# EasyEDA Pro project ProPrj_Isolated Current Sensing_latest_2025-08-29.epro, board PCB_Isolated Current Sensing
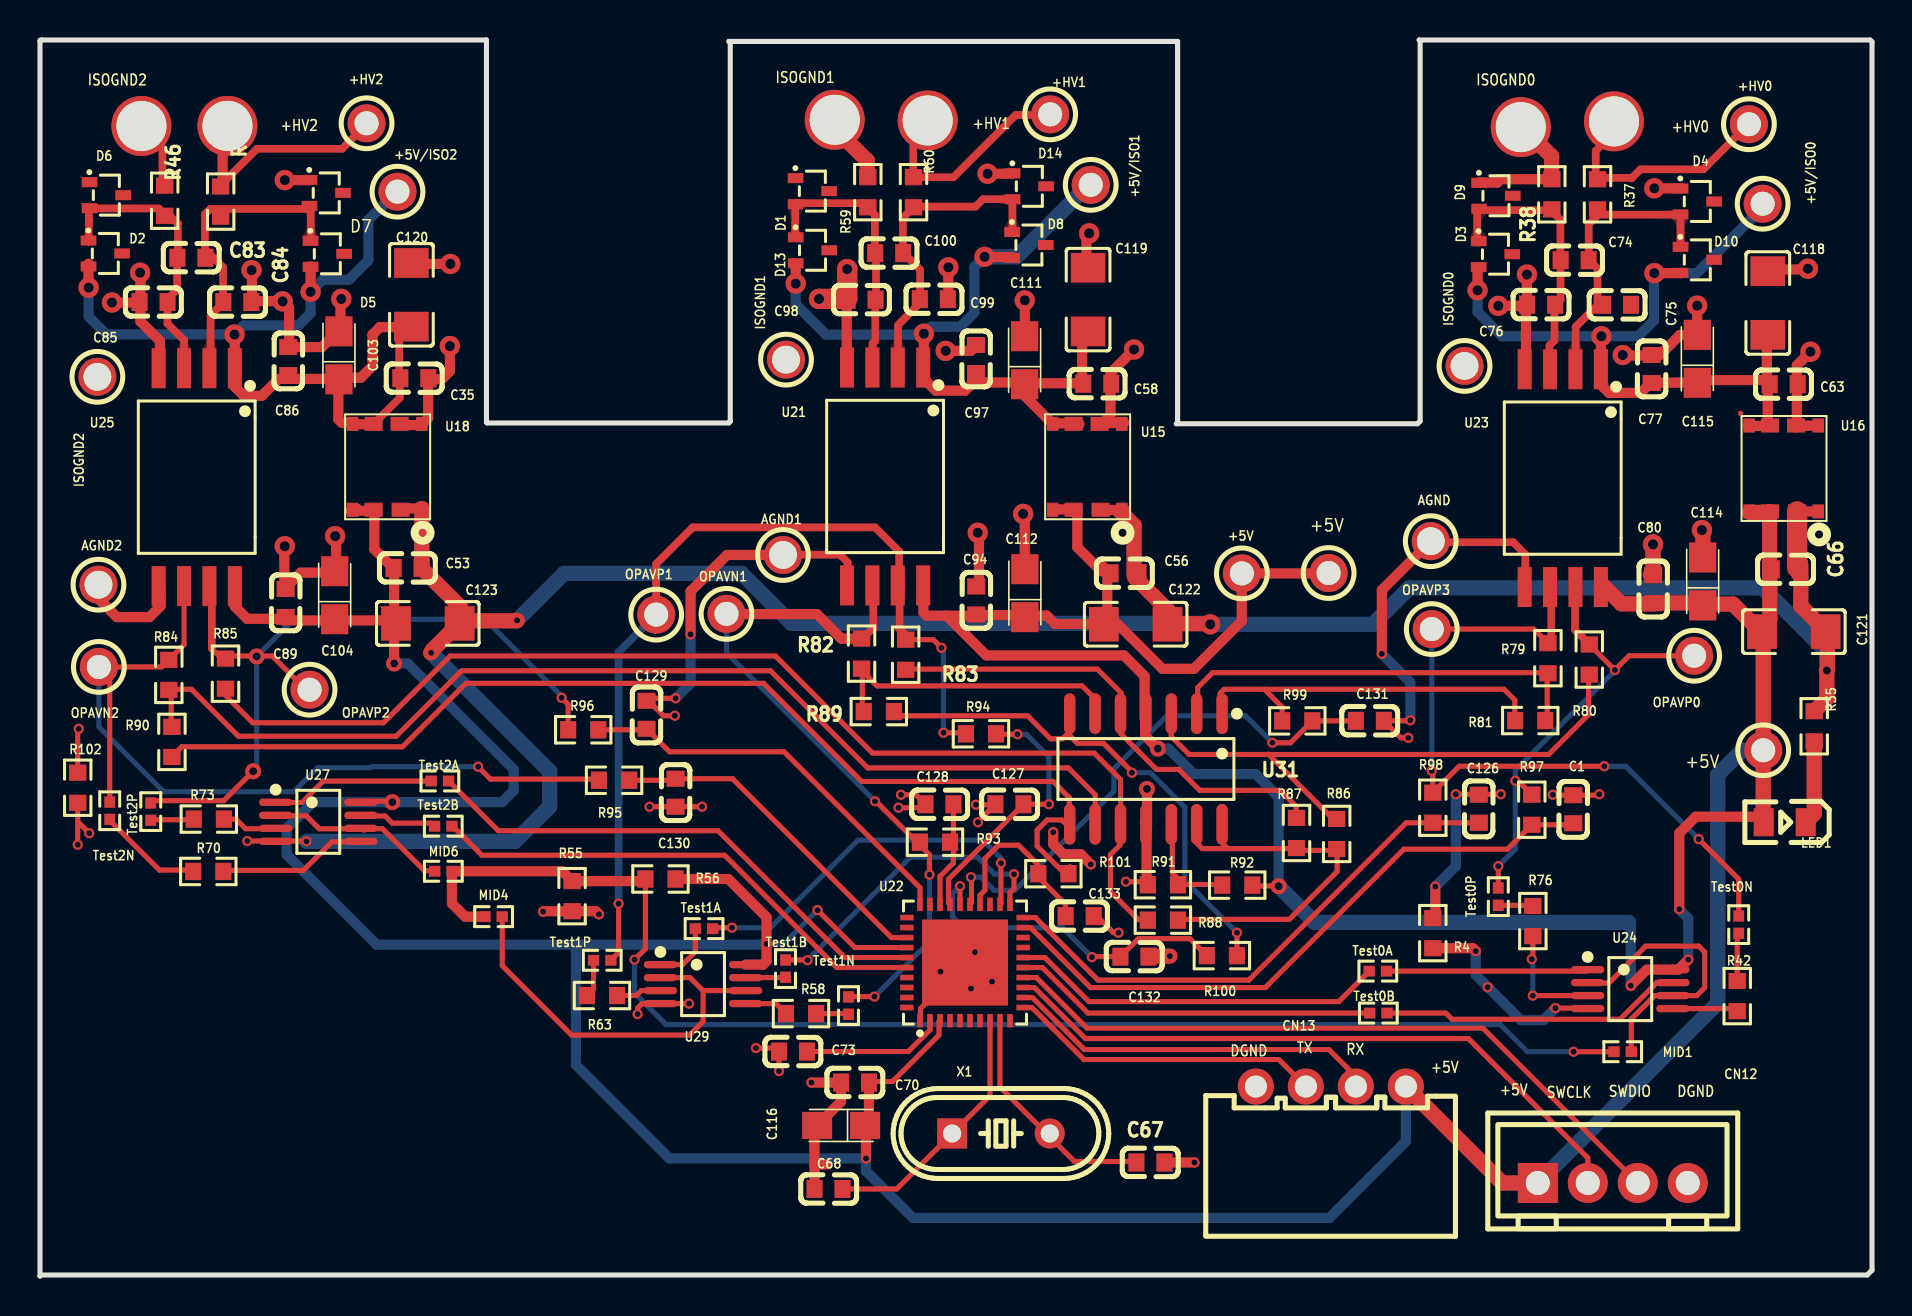
[diagram p1: board, top side]
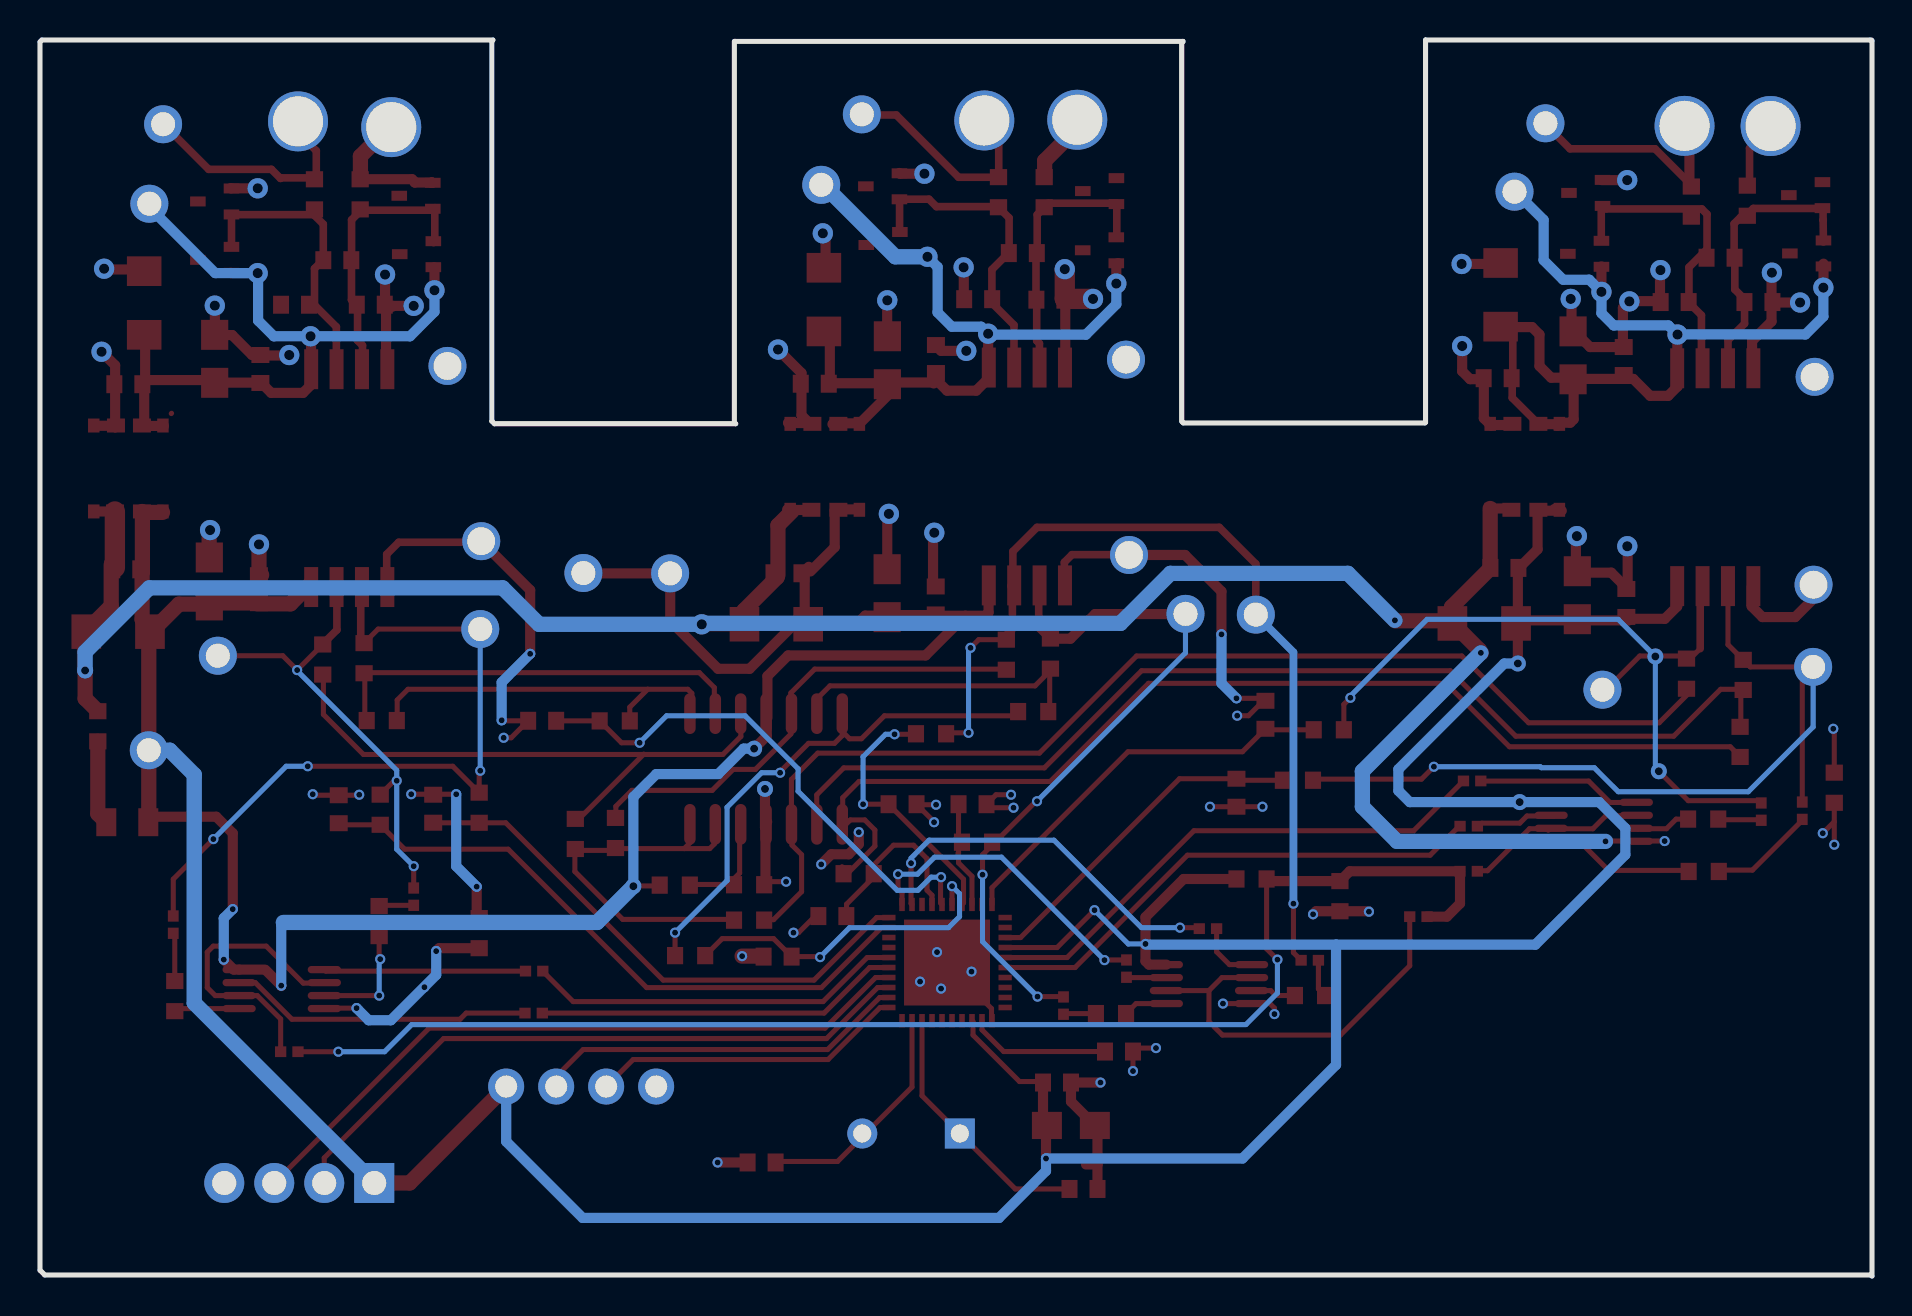
[diagram p2: board, bottom side, seen from below]

Outline 91.63 x 61.84 mm; copper layers: Top Layer, Bottom Layer. Coordinates in mm from the lower left corner of the outline.
Outline path: 0,61.81 0.03,61.84 0.11,61.84 22.32,61.84 22.33,61.84 22.33,42.71 22.36,42.68 34.44,42.68 34.52,42.76 34.52,61.71 34.46,61.77 56.89,61.77 56.9,61.76 56.9,42.71 56.83,42.64 68.9,42.64 69.03,42.77 69.03,61.8 68.98,61.84 91.53,61.84 91.63,61.75 91.63,0.29 91.39,0.05 0.05,0.05 0,0 0,61.81
Stack: Top Layer 0.035mm - / Dielectric1 1.51mm FR4 er 4.5 / Bottom Layer 0.035mm -

## Design rules (mm)
net DGND: GND
net +5V/LS: Power
net ISOGND2: GND
net +5V/ISO2: Power
net ISOGND1: GND
net +5V/ISO1: Power
net AGND: GND
net $1N35: Signal
net $1N45: Signal
net $1N52: Signal
net $1N51: Signal
net $1N17195: Signal
net $1N17335: Signal
net $1N17455: Signal
net $1N17583: Signal
net $1N17553: Signal
net $1N17845: Signal
net $1N17858: Signal
net $1N17725: Signal
net ISOGND0: GND
net +5V/ISO0: Power
template: JLCPCB Capability(Two Layers Board)
spacing copperThickness1oz (default): track to track 0.102, other pairs 0.152 to 0.3
spacing copperThickness2oz: track to track 0.203, other pairs 0.152 to 0.3
track width copperThickness1oz (default): min 0.127, default 0.254, max 2.54
track width copperThickness2oz: min 0.203, default 0.254, max 2.54
differential pair differentialPair (default): width min 0.127, default 0.254, max 2.54; gap min 0.152, default 0.152
via viaSize (default): diameter min 0.5, default 0.61, max 10; hole min 0.3, default 0.305, max 6.3

## Placement (name value [footprint] x y rotation side)
+5V  RH-5000  [TEST-TH_BD2.54-P1.4_RED]  64.45 35.17 0 top
+5V#2  RH-5000  [TEST-TH_BD2.54-P1.4_RED]  60.11 35.16 0 top
+5V#3  RH-5000  [TEST-TH_BD2.54-P1.4_RED]  86.19 26.31 0 top
+5V/ISO0  RH-5000  [TEST-TH_BD2.54-P1.4_RED]  86.16 53.65 0 top
+5V/ISO1  RH-5000  [TEST-TH_BD2.54-P1.4_RED]  52.55 54.6 0 top
+5V/ISO2  RH-5000  [TEST-TH_BD2.54-P1.4_RED]  17.88 54.25 0 top
+HV0  RH-5000  [TEST-TH_BD2.54-P1.4_RED]  85.47 57.63 0 top
+HV1  RH-5000  [TEST-TH_BD2.54-P1.4_RED]  50.52 58.12 0 top
+HV2  RH-5000  [TEST-TH_BD2.54-P1.4_RED]  16.33 57.68 0 top
AGND  5003  [TEST-TH_BD2.54-P1.39]  69.56 36.77 0 top
AGND1  5003  [TEST-TH_BD2.54-P1.39]  37.16 36.08 90 top
AGND2  5003  [TEST-TH_BD2.54-P1.39]  2.92 34.59 270 top
C1  100nF  [C0603]  76.69 23.36 90 top
C35  100nF  [C0603]  18.72 44.92 0 top
C53  100nF  [C0603]  18.38 35.43 0 top
C56  100nF  [C0603]  54.24 35.16 0 top
C58  100nF  [C0603]  52.88 44.64 0 top
C63  100nF  [C0603]  87.21 44.62 0 top
C66  100nF  [C0603]  87.31 35.36 0 top
C67  20pF  [C0603]  55.54 5.68 0 top
C68  20pF  [C0603]  39.44 4.36 180 top
C70  100nF  [C0603]  40.76 9.68 0 top
C73  4.7uF  [C0603]  37.66 11.23 0 top
C74  100nF  [C0603]  76.76 50.83 0 top
C75  10nF  [C0603]  78.87 48.6 180 top
C76  10nF  [C0603]  75.08 48.6 0 top
C77  100nF  [C0603]  80.61 45.38 270 top
C80  100nF  [C0603]  80.68 34.36 270 top
C83  100nF  [C0603]  7.57 50.95 0 top
C84  10nF  [C0603]  9.87 48.73 180 top
C85  10nF  [C0603]  5.68 48.73 0 top
C86  100nF  [C0603]  12.42 45.78 270 top
C89  100nF  [C0603]  12.29 33.68 270 top
C94  100nF  [C0603]  46.83 33.8 270 top
C97  100nF  [C0603]  46.82 45.88 270 top
C98  10nF  [C0603]  41.09 48.85 0 top
C99  10nF  [C0603]  44.71 48.88 180 top
C100  100nF  [C0603]  42.47 51.18 0 top
C103  1uF  [CASE-A_3216]  14.95 46.06 90 top
C104  1uF  [CASE-A_3216]  14.74 34.06 90 top
C111  1uF  [CASE-A_3216]  49.25 45.82 90 top
C112  1uF  [CASE-A_3216]  49.26 34.17 90 top
C114  1uF  [CASE-A_3216]  83.16 34.75 90 top
C115  1uF  [CASE-A_3216]  82.89 45.89 90 top
C116  1uF  [CASE-A_3216]  40.07 7.53 180 top
C118  22uF  [C1206]  86.42 48.68 90 top
C119  22uF  [C1206]  52.42 48.85 90 top
C120  22uF  [C1206]  18.58 49.09 90 top
C121  10uF  [C1206]  87.72 32.24 0 top
C122  10uF  [C1206]  54.8 32.61 0 top
C123  10uF  [C1206]  19.4 32.65 0 top
C126  100nF  [C0603]  71.96 23.38 90 top
C127  100nF  [C0603]  48.49 23.61 180 top
C128  100nF  [C0603]  44.99 23.61 180 top
C129  100nF  [C0603]  30.34 28.08 90 top
C130  100nF  [C0603]  31.79 24.18 270 top
C131  100nF  [C0603]  66.51 27.78 0 top
C132  100nF  [C0603]  54.74 15.98 0 top
C133  100nF  [C0603]  52 18.01 0 top
CN12  XH-4A-R  [CONN-TH_XH-4A-RED]  78.66 4.66 0 top
CN13  XH-4AW米色  [CONN-TH_XH2.54-4AW]  64.56 9.48 180 top
D1  ESD1P0RFW H6327  [SOT-323-3_L2.0-W1.3-P1.30-LS2.1-BL]  38.63 54.28 270 top
D2  ESD1P0RFW H6327  [SOT-323-3_L2.0-W1.3-P1.30-LS2.1-BL]  3.27 51.16 270 top
D3  ESD1P0RFW H6327  [SOT-323-3_L2.0-W1.3-P1.30-LS2.1-BL]  72.8 51.13 270 top
D4  ESD1P0RFW H6327  [SOT-323-3_L2.0-W1.3-P1.30-LS2.1-BL]  82.89 53.76 270 top
D5  ESD1P0RFW H6327  [SOT-323-3_L2.0-W1.3-P1.30-LS2.1-BL]  14.37 51.14 270 top
D6  ESD1P0RFW H6327  [SOT-323-3_L2.0-W1.3-P1.30-LS2.1-BL]  3.32 54.08 270 top
D7  ESD1P0RFW H6327  [SOT-323-3_L2.0-W1.3-P1.30-LS2.1-BL]  14.32 54.19 270 top
D8  ESD1P0RFW H6327  [SOT-323-3_L2.0-W1.3-P1.30-LS2.1-BL]  49.46 51.59 270 top
D9  ESD1P0RFW H6327  [SOT-323-3_L2.0-W1.3-P1.30-LS2.1-BL]  72.82 54.05 270 top
D10  ESD1P0RFW H6327  [SOT-323-3_L2.0-W1.3-P1.30-LS2.1-BL]  82.89 50.84 270 top
D13  ESD1P0RFW H6327  [SOT-323-3_L2.0-W1.3-P1.30-LS2.1-BL]  38.64 51.32 270 top
D14  ESD1P0RFW H6327  [SOT-323-3_L2.0-W1.3-P1.30-LS2.1-BL]  49.48 54.52 270 top
ISOGND0  5003  [TEST-TH_BD2.54-P1.39]  71.25 45.54 90 top
ISOGND1  5003  [TEST-TH_BD2.54-P1.39]  37.31 45.85 270 top
ISOGND2  5003  [TEST-TH_BD2.54-P1.39]  2.87 44.99 90 top
LED1  whiteLEDSMD  [LED0805-R-RD]  87.26 22.71 180 top
MID1  0Ω  [R0402]  79.16 11.22 0 top
MID4  0Ω  [R0402]  22.69 17.98 0 top
MID6  10kΩ  [R0402]  20.17 20.25 180 top
NOREF  -  [Pad_e4196]  9.38 57.55 0 top
NOREF#2  -  [Pad_e4225]  74.06 57.48 0 top
NOREF#3  -  [Pad_e4200]  5.07 57.54 0 top
NOREF#4  -  [Pad_e4212]  39.75 57.85 0 top
NOREF#5  -  [Pad_e4216]  44.4 57.82 0 top
NOREF#6  -  [Pad_e4224]  78.72 57.77 0 top
OPAVN1  OUT1N  [TEST-TH_BD2.54-P1.4_RED]  34.34 33.13 0 top
OPAVN2  OUT2N  [TEST-TH_BD2.54-P1.4_RED]  2.94 30.48 0 top
OPAVP0  OUT0P  [TEST-TH_BD2.54-P1.4_RED]  82.73 31.04 0 top
OPAVP1  OUT1P  [TEST-TH_BD2.54-P1.4_RED]  30.82 33.09 0 top
OPAVP2  OUT2P  [TEST-TH_BD2.54-P1.4_RED]  13.48 29.34 0 top
OPAVP3  OUT0N  [TEST-TH_BD2.54-P1.4_RED]  69.61 32.37 0 top
R4  0Ω  [R0603]  69.66 17.16 270 top
R35  500  [R0603]  88.74 27.51 270 top
R37  1kΩ  [R0603]  77.9 54.12 270 top
R38  1kΩ  [R0603]  75.61 54.12 270 top
R42  10kΩ  [R0603]  84.89 14.01 270 top
R45  1kΩ  [R0603]  9.04 53.76 270 top
R46  1kΩ  [R0603]  6.24 53.8 270 top
R55  1MΩ  [R0603]  26.61 19.01 270 top
R56  1MΩ  [R0603]  31.03 19.86 180 top
R58  10kΩ  [R0603]  38.06 13.13 180 top
R59  1kΩ  [R0603]  41.4 54.23 270 top
R60  1kΩ  [R0603]  43.69 54.23 270 top
R63  10kΩ  [R0603]  28.11 14.03 0 top
R70  10kΩ  [R0603]  8.42 20.24 0 top
R73  10kΩ  [R0603]  8.44 22.86 0 top
R76  10kΩ  [R0603]  74.67 17.76 270 top
R79  10kΩ  [R0603]  75.42 30.91 270 top
R80  10kΩ  [R0603]  77.49 30.85 270 top
R81  10kΩ  [R0603]  74.54 27.79 180 top
R82  10kΩ  [R0603]  41.09 31.14 270 top
R83  10kΩ  [R0603]  43.3 31.09 270 top
R84  10kΩ  [R0603]  6.44 30.08 270 top
R85  10kΩ  [R0603]  9.28 30.14 270 top
R86  10kΩ  [R0603]  64.86 22.12 90 top
R87  10kΩ  [R0603]  62.85 22.17 90 top
R88  10kΩ  [R0603]  56.16 17.81 180 top
R89  10kΩ  [R0603]  41.95 28.24 0 top
R90  10kΩ  [R0603]  6.6 26.72 270 top
R91  1MΩ  [R0603]  56.16 19.58 180 top
R92  1MΩ  [R0603]  59.88 19.56 180 top
R93  5kΩ  [R0603]  44.76 21.71 0 top
R94  5kΩ  [R0603]  47.06 27.13 0 top
R95  5kΩ  [R0603]  28.71 24.81 0 top
R96  5kΩ  [R0603]  27.17 27.33 0 top
R97  5kΩ  [R0603]  74.61 23.33 90 top
R98  5kΩ  [R0603]  69.66 23.43 90 top
R99  5kΩ  [R0603]  62.88 27.78 180 top
R100  5kΩ  [R0603]  59.11 16.03 0 top
R101  5kΩ  [R0603]  50.68 20.13 0 top
R102  0Ω  [R0603]  1.89 24.43 270 top
Test0A  0Ω  [R0402]  66.91 15.26 0 top
Test0B  0Ω  [R0402]  66.94 13.16 0 top
Test0N  0Ω  [R0402]  84.96 17.58 90 top
Test0P  0Ω  [R0402]  72.94 18.98 270 top
Test1A  0Ω  [R0402]  33.21 17.38 0 top
Test1B  0Ω  [R0402]  37.29 15.38 90 top
Test1N  0Ω  [R0402]  40.44 13.53 90 top
Test1P  0Ω  [R0402]  28.12 15.8 180 top
Test2A  0Ω  [R0402]  20 24.77 0 top
Test2B  0Ω  [R0402]  20.17 22.51 0 top
Test2N  0Ω  [R0402]  3.49 23.28 90 top
Test2P  0Ω  [R0402]  5.54 23.24 270 top
U15  MIE1W0505  [LGA-MPS]  52.38 40.49 90 top
U16  MIE1W0505  [LGA-MPS]  87.21 40.41 90 top
U18  MIE1W0505  [LGA-MPS]  17.37 40.49 90 top
U21  AMC1300BDWV  [SOIC-8_L7.5-W5.9-P1.27-LS11.5-BL-1]  42.27 40 180 top
U22  MPF66200  [VQFN-40_L6.0-W6.0-P0.50-TL-EP4.3]  46.26 15.68 90 top
U23  AMC1300BDWV  [SOIC-8_L7.5-W5.9-P1.27-LS11.5-BL-1]  76.16 39.92 180 top
U24  TLV3202AIDGKR  [VSSOP-8_L3.0-W3.0-P0.65-LS5.0-BL]  79.54 14.36 270 top
U25  AMC1300BDWV  [SOIC-8_L7.5-W5.9-P1.27-LS11.5-BL-1]  7.84 39.97 180 top
U27  TLV3202AIDGKR  [VSSOP-8_L3.0-W3.0-P0.65-LS5.0-BL]  13.92 22.73 270 top
U29  TLV3202AIDGKR  [VSSOP-8_L3.0-W3.0-P0.65-LS5.0-BL]  33.16 14.61 270 top
U31  TLV9064IDR  [SOIC-14_L8.7-W3.9-P1.27-LS6.0-BL]  55.31 25.37 180 top
X1  -  [HC-49US_L11.5-W4.5-P4.88]  48.06 7.13 0 top

## Footprints (pads in the part's own frame, mm; a bottom-side part is the same pattern mirrored in y, then rotated)
C0603
  rect 0.8x0.9 smd: 1(-0.7,0) 2(0.7,0)
C1206
  rect 1.485x1.728 smd: 1(-1.593,0) 2(1.593,0)
CASE-A_3216
  rect 1.5x1.359 smd: 1(-1.2,0) 2(1.2,0)
CONN-TH_XH2.54-4AW
  round 1.8 hole 1.1: 1(-3.751,0) 2(-1.248,0) 3(1.251,0) 4(3.751,0)
CONN-TH_XH-4A-RED
  rect 2x2 hole 1.2: 1(-3.75,0)
  round 2 hole 1.2: 2(-1.25,0) 3(1.25,0) 4(3.75,0)
HC-49US_L11.5-W4.5-P4.88
  rect 1.5x1.5 hole 0.9: 1(-2.44,0)
  round 1.5 hole 0.9: 2(2.44,0)
LED0805-R-RD
  rect 1x1.399 smd: 1(1.05,0) 2(-1.05,0)
LGA-MPS
  rect 0.7x0.575 smd: 1(-2.15,-1.73) 2(2.15,-1.73) 7(2.15,1.73) 8(-2.15,1.73)
  rect 0.7x0.9 smd: 3/4(2.15,-0.62) 5/6(2.15,0.68) 10/9(-2.15,0.68) 12/11(-2.15,-0.67)
Pad_e4196
  round 3 hole 2.5: 1(0,0)
Pad_e4200
  round 3 hole 2.5: 1(0,0)
Pad_e4212
  round 3 hole 2.5: 1(0,0)
Pad_e4216
  round 3 hole 2.5: 1(0,0)
Pad_e4224
  round 3 hole 2.5: 1(0,0)
Pad_e4225
  round 3 hole 2.5: 1(0,0)
R0402
  rect 0.566x0.54 smd: 1(-0.433,0) 2(0.433,0)
R0603
  rect 0.806x0.864 smd: 1(-0.753,0) 2(0.753,0)
SOIC-8_L7.5-W5.9-P1.27-LS11.5-BL-1
  rect 0.7x2 smd: 1(-1.905,-5.45) 2(-0.635,-5.45) 3(0.635,-5.45) 4(1.905,-5.45) 5(1.905,5.45) 6(0.635,5.45) 7(-0.635,5.45) 8(-1.905,5.45)
SOIC-14_L8.7-W3.9-P1.27-LS6.0-BL
  oval 0.574x2.038 smd: 1(-3.81,-2.769) 2(-2.54,-2.769) 3(-1.27,-2.769) 4(0,-2.769) 5(1.27,-2.769) 6(2.54,-2.769) 7(3.81,-2.769) 8(3.81,2.769) 9(2.54,2.769) 10(1.27,2.769) 11(0,2.769) 12(-1.27,2.769) 13(-2.54,2.769) 14(-3.81,2.769)
SOT-323-3_L2.0-W1.3-P1.30-LS2.1-BL
  rect 0.5x0.78 smd: 1(-0.65,-0.84) 2(0.65,-0.84) 3(0,0.84)
TEST-TH_BD2.54-P1.4_RED
  round 1.9 hole 1.2: 1(0,0)
TEST-TH_BD2.54-P1.39
  round 1.9 hole 1.39: 1(0,0)
VQFN-40_L6.0-W6.0-P0.50-TL-EP4.3
  rect 0.665x0.28 smd: 1(-2.908,2.25) 2(-2.908,1.75) 3(-2.908,1.25) 4(-2.908,0.75) 5(-2.908,0.25) 6(-2.908,-0.25) 7(-2.908,-0.75) 8(-2.908,-1.25) 9(-2.908,-1.75) 10(-2.908,-2.25) 21(2.908,-2.25) 22(2.908,-1.75) 23(2.908,-1.25) 24(2.908,-0.75) 25(2.908,-0.25) 26(2.908,0.25) 27(2.908,0.75) 28(2.908,1.25) 29(2.908,1.75) 30(2.908,2.25)
  rect 0.28x0.665 smd: 11(-2.25,-2.908) 12(-1.75,-2.908) 13(-1.25,-2.908) 14(-0.75,-2.908) 15(-0.25,-2.908) 16(0.25,-2.908) 17(0.75,-2.908) 18(1.25,-2.908) 19(1.75,-2.908) 20(2.25,-2.908) 31(2.25,2.908) 32(1.75,2.908) 33(1.25,2.908) 34(0.75,2.908) 35(0.25,2.908) 36(-0.25,2.908) 37(-0.75,2.908) 38(-1.25,2.908) 39(-1.75,2.908) 40(-2.25,2.908)
  rect 4.3x4.3 smd: 41(0,0)
VSSOP-8_L3.0-W3.0-P0.65-LS5.0-BL
  oval 0.364x1.662 smd: 1(-0.975,-2.131) 2(-0.325,-2.131) 3(0.325,-2.131) 4(0.975,-2.131) 5(0.975,2.131) 6(0.325,2.131) 7(-0.325,2.131) 8(-0.975,2.131)

## Nets
As in the schematic, except:
+HV0: +HV0.1 NOREF#6.1 R37.1
+HV1: +HV1.1 NOREF#5.1 R60.1
+HV2: +HV2.1 NOREF.1 R45.1
ISOGND0: C63.2 C75.1 C76.1 C77.1 C115.2 C118.2 D4.1 D9.1 ISOGND0.1 NOREF#2.1 R38.1 U16.2 U16.3/4 U23.4
ISOGND1: C58.2 C97.1 C98.1 C99.1 C111.2 C119.2 D1.1 D14.1 ISOGND1.1 NOREF#4.1 R59.1 U15.2 U15.3/4 U21.4
ISOGND2: C35.2 C84.1 C85.1 C86.1 C103.2 C120.2 D6.1 D7.1 ISOGND2.1 NOREF#3.1 R46.1 U18.2 U18.3/4 U25.4
PA09: C132.1 R100.1 U22.26

Pads without a net: D1 3; D2 3; D3 3; D4 3; D5 3; D6 3; D7 3; D8 3; D9 3; D10 3; D13 3; D14 3; U22 4 5 6 7 10 17 18 23 29 31 32 37 38 39 40

## Via types
v1: diameter 0.508, hole 0.3, Top Layer to Bottom Layer, 76 vias
v2: diameter 1.016, hole 0.508, Top Layer to Bottom Layer, 39 vias
v3: diameter 0.8, hole 0.399, Top Layer to Bottom Layer, 8 vias
v4: diameter 0.508, hole 0.299, Top Layer to Bottom Layer, 4 vias

## Routing (per net, layer and track width the routed paths; a pad name or vN(x,y) marks a point on that pad's centre or on a via; arc(x,y) is an arc through that point)
AGND: length 94
  Top Layer w0.254: v1(70.81,24.11) 71.94,24.11 C126.2 71.99,24.11 v1(73.06,24.11) ; v1(30.49,23.48) C130.2 v1(33.11,23.48) ; v1(54.31,19.73) 55.26,19.73 R91.2 ; 47.76,23.58 46.91,22.73 v1(46.91,22.71) ; 47.76,23.58 v1(46.81,23.58) ; 47.76,23.58 C127.2 ; v1(75.66,24.08) 75.69,24.06 C1.2 77.94,24.06 v1(77.99,24.11) ; v1(68.44,26.93) 68.06,26.93 C131.2 68.51,27.78 v1(68.54,27.81) ; v1(1.94,27.38) 1.89,27.33 R102.1 ; v1(53.94,17.18) 53.69,17.18 52.69,18.18 ; v1(31.75,28.03) 31.18,28.03 30.44,28.78 C129.2 30.46,28.91 v1(31.79,28.91) ; v1(42.94,23.43) 44.11,23.43 C128.2 43.81,24.08 v1(43.06,24.08) ; 55.4,22.28 55.38,22.75 55.4,22.73 55.4,22.28
  Top Layer w0.381: 40.44,34.37 40.4,34.41 40.4,35.71 40.01,36.09 37.24,36.09 37.11,35.96 ; 69.23,36.71 73.69,36.71 74.29,36.11 74.29,34.28 74.3,34.27 ; 83.15,35.69 83.17,35.71 ; 83.17,37.28 v2(83.12,37.32)
  Top Layer w0.508: 6.02,34.5 6.02,33.51 5.48,32.97 3.84,32.97 2.91,33.9 2.91,34.61 ; 14.81,35.23 14.81,36.97 v2(14.76,37.02) ; AGND.1 69.51,36.71 67.11,34.32 v1(67.11,31.13) ; 55.34,19.6 55.34,22.43 ; v1(52.56,20.6) 52.05,21.1 51.18,21.1 50.68,21.61 v1(50.68,22.21) ; v1(69.79,19.48) 69.79,18.03 R4.1 ; v1(32.54,32.11) 32.54,34.26 34.36,36.08 AGND1.1 ; 46.96,34.74 46.96,37.13 v2(46.9,37.19) ; 12.34,34.49 13.04,35.19 14.5,35.19 ; v3(55.37,24.37) 55.37,22.45 55.34,22.43 ; v2(12.24,36.51) 12.22,36.49 12.22,34.43 ; 55.34,22.43 55.34,22.64 55.26,22.73 ; 49.25,35.46 49.25,38.05 v2(49.17,38.13)
  Top Layer w0.762: 83.17,35.71 83.17,37.28 ; C132.2 55.46,16.01 v1(56.51,16.01) ; 80.54,35.08 80.68,35.21 v2(80.68,36.61)
  Bottom Layer w0.508: v1(67.11,31.13) 68.54,29.71 v1(68.54,27.81) ; v1(69.79,19.48) 70.81,20.51 v1(70.81,24.11) ; v1(31.79,28.91) 32.54,29.66 v1(32.54,32.11)
DGND: length 167.3
  Top Layer w0.254: v1(29.89,13.11) 29.89,13.41 30.11,13.63 U29.4 v1(32.46,13.63) 32.51,13.58 ; R102.2 1.89,22.73 ; 1.89,22.73 v1(2.46,22.16) ; 1.89,22.73 v1(1.89,21.58) ; 38.82,7.58 C116.2 38.74,7.4 ; 89.4,30.33 v3(89.37,30.3) ; v1(13.33,21.75) 13.31,21.77 10.37,21.77 10.36,21.77 ; v1(75.8,13.41) 77.38,13.41 U24.4 ; v1(57.74,5.68) 57.79,5.63 ; v1(36.96,10.26) C73.1 36.79,11.41 v1(35.81,11.41) ; 44.04,12.63 44.04,13.38 46.26,15.61 U22.41 ; 75.79,13.41 75.61,13.41
  Top Layer w0.508: U16.12/11 U16.1 ; 38.69,4.41 C68.2 38.74,5.58 ; 53,38.33 54.23,38.33 54.26,38.36 ; 56.41,32.64 56.41,32.3 ; v1(38.59,9.68) C70.1 40.06,8.73 C116.2 ; 17.97,38.4 19.1,38.4 19.21,38.29 ; v1(25.16,18.23) 25.18,18.25 R55.2 27.8,18.25 v1(27.96,18.1) ; 21.03,32.78 21.03,32.11 ; 38.74,5.58 39.31,5.58 ; 38.74,5.58 38.74,7.4 ; v1(71.81,16.26) 71.67,16.4 R4.2 ; C67.2 v1(57.74,5.68)
  Top Layer w0.762: 54.76,35.29 54.76,34.96 56.41,33.31 56.41,32.64 58.5,32.64 v2(58.53,32.61) ; v1(23.86,32.81) 23.84,32.78 21.03,32.78 21.03,33.47 19.1,35.4 19.1,38.4 ; 89.34,32.25 88.07,33.53 88.07,35.58 ; 19.54,31.18 19.64,31.28 19.64,31.33 20.83,32.53 21.03,32.53 ; 54.03,38.25 54.72,37.56 54.72,35.08 ; R35.1 89.37,28.89 v3(89.37,30.3) ; 89.4,32.15 89.4,30.33
  Top Layer w1.016: 87.88,38.25 87.88,35.44
  Bottom Layer w0.508: v1(71.81,16.26) 71.81,15.06 74.08,12.8 75.19,12.8 v1(75.8,13.41)
  Bottom Layer w0.762: v1(23.86,32.81) 26.21,35.16 35.09,35.16 37.59,32.66 58.48,32.66 v2(58.53,32.61) 66.66,32.61 68.49,34.43 86.16,34.43 89.37,31.22 v3(89.37,30.3) ; v1(13.33,21.75) 23.75,21.75 25.49,23.48 25.49,25.26 v1(19.56,31.18)
  vias: v1(10.37,21.76) v1(45.04,15.23) v1(46.56,14.38) v1(46.76,16.21) v1(47.61,14.73) v1(72.4,14.45)
(no net): length 0
  Top Layer w0.254: 85.05,43.17 85.06,43.15
+5V/ISO0: length 39.6
  Top Layer w0.508: 86.55,42.52 86.54,42.53 85.43,42.53 ; 86.42,44.68 86.27,44.83 82.66,44.83 ; 86.42,44.68 86.42,44.81 ; 86.42,44.68 86.42,42.67 86.51,42.57 ; C115.1 82.88,44.7 80.58,44.7 80.06,44.19 78.47,44.19 78.07,44.59 78.07,47 v2(78.1,47.02) ; 82.09,50.2 82.08,50.18 v2(80.74,50.18) ; 86.33,44.78 86.37,44.83 86.37,47.03 ; 71.92,50.47 71.9,50.45 v2(71.9,49.32)
  Bottom Layer w0.508: v2(71.9,49.32) 71.9,48.24 73.12,47.02 v2(78.1,47.02) 79.93,47.02 80.72,47.81 80.72,50.16 v2(80.74,50.18) 82.86,50.18 86.21,53.52
+5V/ISO1: length 40.1
  Top Layer w0.508: 50.65,42.66 51.95,42.66 51.99,42.62 ; 44.19,45.45 44.19,44.91 44.8,44.3 46.27,44.3 46.77,44.81 ; 44.2,45.71 44.21,45.71 v2(44.21,47.15) ; 49.45,44.67 51.9,44.67 51.93,44.63 52.12,44.82 ; 49.15,44.51 49.15,44.13 50.61,42.68 ; 49.15,44.51 49.1,44.51 49.04,44.58 ; 49.15,44.51 49.15,44.63 ; 48.62,50.98 47.24,50.98 47.19,50.94 ; v2(37.8,49.66) 37.8,50.59 37.71,50.68 ; 46.93,44.66 46.88,44.71 48.91,44.71 49.01,44.61 ; 52.12,44.82 52.12,46.66 52.49,47.02 ; 52.12,44.82 52.16,44.82 ; 49.01,44.61 48.98,44.58 49.04,44.58 ; 49.01,44.61 49.04,44.58
  Bottom Layer w0.508: v2(37.8,49.66) 37.8,48.62 39.32,47.1 44.16,47.1 v2(44.21,47.15) 44.56,47.5 46.02,47.5 46.73,48.21 46.73,50.49 v2(47.24,51)
  Bottom Layer w0.762: 52.67,54.62 52.47,54.62 48.85,51 v2(47.24,51)
+5V/ISO2: length 47.7
  Top Layer w0.381: 16.74,42.68 18,43.94 18,45.07 ; 17.97,44.99 17.97,46.99 18.52,47.55
  Top Layer w0.508: 2.42,49.42 2.43,49.43 2.43,50.65 ; 17.85,47.48 17,47.48 16.63,47.11 16.63,45.53 16.05,44.95 14.78,44.95 14.72,44.89 12.51,44.89 12.56,44.93 ; v2(13.53,49.24) 13.53,50.51 ; 14.92,44.94 14.92,42.86 15.09,42.69 15.59,42.69 15.74,42.55 15.81,42.62 16.73,42.62 ; v2(9.73,47.11) 9.74,47.1 9.74,45.32 9.73,45.33 9.73,44.51 10.19,44.04 11.09,44.04 11.94,44.89 12.51,44.89
  Bottom Layer w0.508: 17.86,54.27 16.42,52.84 16.42,50.83 15.45,49.85 14.14,49.85 v2(13.53,49.24) 13.53,48.17 12.92,47.56 10.19,47.56 9.74,47.11 ; v2(2.43,49.45) 2.43,48.01 3.33,47.11 9.74,47.11 ; 9.74,47.11 9.77,47.11 9.78,47.11
+5V/LS: length 311.2
  Top Layer w0.254: 15.56,23.76 17.58,23.76 v3(17.62,23.71) ; v1(38.89,18.31) 40.76,16.43 U22.34 ; 41.46,9.68 41.51,9.73 42.64,9.73 44.96,12.06 44.96,12.73 45.02,12.78 ; 62.01,19.55 61.98,19.52 60.69,19.52
  Top Layer w0.508: 17.71,35.37 16.73,36.36 16.73,38.29 ; 17.71,35.37 17.71,35.4 ; 17.71,35.37 17.71,32.55 ; 53.18,35.49 53.38,35.28 53.38,32.87 53.14,32.62 ; 80.34,15.31 v1(79.56,14.53) 79.56,14.51 ; v3(55.91,26.39) 55.28,27.02 55.28,27.75 ; 50.72,38.36 51.84,38.36 51.88,38.31 51.88,36.47 53.09,35.25 ; 45.35,33.04 46.81,33.04 46.85,33.07 49.26,33.07 ; 45.35,33.04 44.35,33.04 44.19,33.2 44.19,34.74 44.18,34.75 ; 45.35,33.04 47.33,31.05 54.21,31.05 55.25,30.02 55.25,27.92 ; 53.14,32.62 50.78,32.62 50.35,33.04 48.91,33.04 ; 53.14,32.62 53.89,32.62 56.14,30.38 57.71,30.38 60.11,32.77 60.11,35.15 +5V#2.1 64.43,35.16 +5V.1 ; 16.74,38.31 16.73,38.29 ; 16.73,38.29 15.79,38.29 ; 41.46,9.68 41.46,7.73 C116.1 41.31,7.49 v1(41.31,5.88) ; 17.71,32.55 17.89,32.38 ; 17.71,32.55 17.71,30.61 ; 80.39,15.33 U24.8 81.94,15.33 v1(82.44,15.83) ; 9.76,34.76 9.74,34.74 9.74,33.5 10.36,32.88 12.1,32.88 12.18,32.8 17.67,32.8 ; 15.79,38.29 15.88,38.38 ; 15.79,38.29 15.52,38.29 ; v1(81.99,18.36) 81.99,22.16 82.81,22.98 85.94,22.98 86.19,22.73 ; U29.8 36.16,15.58 36.34,15.76 v1(36.34,16.62) 36.34,17.96 34.43,19.86 R56.1
  Top Layer w0.762: 85.98,32.31 84.68,33.62 82.85,33.62 ; 85.98,32.31 86.52,32.85 86.52,35.22 ; 85.98,32.31 86.19,32.11 +5V#3.1 86.19,22.73 LED1.1 ; 80.76,33.63 79.1,33.63 78.14,34.59 ; CN12.1 73.14,4.66 CN13.1 ; 86.52,35.22 86.51,35.24 86.51,38.09 ; 86.52,35.22 86.55,35.19 ; 85.5,38.21 86.48,38.21 86.52,38.25 ; 80.85,33.68 83.25,33.68 83.3,33.63
  Bottom Layer w0.254: v1(38.89,18.31) 37.2,16.62 v1(36.34,16.62)
  Bottom Layer w0.508: v1(79.56,14.53) 79.56,17.58 79.46,17.69 ; v3(17.71,30.65) 18.4,30.65 23.69,25.36 23.69,24.28 23.12,23.71 v3(17.62,23.71) 13.64,23.71 12.34,22.41 12.34,21.08 16.84,16.58 26.81,16.58 ; v3(61.95,19.5) 61.95,23.97 60.8,25.11 57.71,25.11 56.43,26.39 v3(55.91,26.39) ; v1(82.44,15.83) 82.44,17.91 v1(81.99,18.36) ; 26.81,16.58 26.81,10.56 31.49,5.88 v1(41.31,5.88) 41.31,5.26 43.66,2.91 64.49,2.91 68.31,6.73 CN13.1 ; 26.81,16.58 36.34,16.58
  Bottom Layer w0.762: 79.46,17.69 63.76,17.69 v3(61.95,19.5) ; CN12.1 83.91,13.66 83.91,25.08 85.14,26.31 +5V#3.1
+HV0: length 11.6
  Top Layer w0.381: 85.44,57.62 83.19,55.37 80.05,55.37 79.6,54.92 79.58,54.95 77.81,54.95 77.81,56.3 78.85,57.34
+HV1: length 10.8
  Top Layer w0.381: 44.24,57.44 43.68,56.88 43.68,55.04 ; 50.5,58.09 48.8,58.09 45.69,54.98 43.65,54.98
+HV2: length 11.5
  Top Layer w0.381: 9.13,54.64 9.1,54.64 10.85,56.4 15.1,56.4 16.42,57.72 ; 9.08,57.27 9.11,57.24 9.11,56.96 9.11,56.96 9.11,57.02
  Top Layer w0.508: 9.65,56.89 9.13,56.37 9.13,54.68 ; 9.13,54.61 9.13,54.64
ISOGND0: length 27.2
  Top Layer w0.508: 74.02,48.49 73.97,48.54 v2(72.94,48.54) ; 72.02,54.7 72.02,54.71 72.03,54.71 ; 72.02,54.7 72.02,54.69 ; 72.02,54.7 72.03,54.71 ; 87.87,44.61 87.87,45.56 v2(88.55,46.24) ; 87.87,44.61 87.87,42.47 ; 87.87,44.61 87.85,44.69 87.85,44.57 ; 74.35,48.55 74.32,48.53 74.32,45.32 ; 87.87,42.47 87.94,42.54 88.88,42.54 ; 87.87,42.47 87.86,42.46 ; v2(80.74,54.42) 82.08,54.42 82.08,54.43 ; 75.62,54.88 75.62,54.81 ; 75.62,54.88 73.02,54.88 72.89,54.75 72.89,54.72 72.88,54.71 72.03,54.71 ; 75.62,54.88 75.65,54.88 ; 82.89,48.56 82.88,48.55 82.88,47.08 ; 82.88,47.08 82.02,47.08 81.03,46.09 80.57,46.09 80.54,46.06 79.16,46.06 ; 82.88,47.08 82.93,47.08 ; 82.88,47.08 82.88,47.07 ; 74.38,48.55 74.37,48.56 v2(74.37,50.11) ; 86.2,50.36 88.07,50.36
  Top Layer w0.762: 75.6,54.88 75.6,56.03 74.15,57.48 NOREF#2.1
  vias: v2(79.16,46.08) v2(82.89,48.55) v2(88.42,50.4)
ISOGND1: length 23.3
  Top Layer w0.508: 53.15,42.68 53.54,43.07 53.54,44.81 ; 53.15,42.68 54.2,42.68 54.21,42.69 ; 53.15,42.68 53.1,42.62 ; 53.54,44.81 53.54,45.18 v2(54.72,46.36) ; 53.54,44.81 53.5,44.76 ; v2(45.43,50.47) 45.42,50.46 45.42,48.84 ; 40.41,45.41 40.35,45.47 40.35,48.86 40.34,48.85 ; 52.34,50.35 52.34,52.03 v2(52.48,52.17) ; 49.26,47.08 49.26,48.81 v2(49.25,48.82) ; v2(45.3,46.29) 46.56,46.29 46.88,46.61 ; v2(47.39,55.15) 48.61,55.15 48.65,55.19
  Top Layer w0.762: 39.73,57.45 41.38,55.8 41.38,55.02
  Top Layer w1.016: v2(38.96,48.89) 40.3,48.89 40.33,48.86 ; 40.33,48.86 40.37,48.91 v2(40.37,50.38) ; 40.33,48.86 40.34,48.85 ; 40.33,48.86 40.31,48.85
ISOGND2: length 29.9
  Top Layer w0.381: 6.13,54.61 6.13,56.43 5.09,57.46
  Top Layer w0.508: 14.88,47.33 15.03,47.48 15.03,48.87 15.03,48.88 ; 5.03,48.69 5.03,47.76 6,46.79 6,45.19 ; 5.03,48.69 5.01,48.71 ; 5.03,48.69 5.03,50.18 v2(5.01,50.2) ; 3.66,48.7 3.67,48.71 5.01,48.71 ; 5.01,48.71 4.94,48.78 ; 19.15,42.64 19.08,42.58 19.08,42.58 ; 17.93,42.58 19.08,42.58 ; 19.08,42.58 19.42,42.92 19.42,44.87 20.1,44.87 20.5,45.27 v2(20.5,46.53) ; 19.08,42.58 19.04,42.55 ; 18.55,50.64 v2(20.52,50.64) ; 10.67,48.78 10.6,48.78 10.6,50.31 v2(10.58,50.33) ; 10.67,48.78 10.6,48.71 ; 10.67,48.78 12.12,48.78 v2(12.14,48.77) 12.46,48.44 12.46,46.48 ; 12.46,46.48 14.1,46.48 14.96,47.34 ; 12.46,46.48 12.32,46.48 ; 12.46,46.48 12.46,46.43 ; v2(12.24,54.83) 13.52,54.83
  vias: v2(3.6,48.71) v2(15.07,48.89)
MID1: length 69.6
  Top Layer w0.254: 76.69,11.21 v1(76.71,11.22) MID1.1 ; v1(29.74,15.83) 30.28,16.37 R56.2
  Top Layer w0.508: MID4.1 21.26,17.98 20.61,18.64 MID6.1 26.12,20.25 R55.1 30.17,19.76 R56.2
  Bottom Layer w0.254: v1(76.71,11.22) 74.4,11.22 73.04,12.58 31.31,12.58 29.74,14.16 v1(29.74,15.83)
OUT0N: length 36.7
  Top Layer w0.254: Test0N.2 84.96,19.86 v1(82.96,21.86) ; v1(78.24,25.51) 70.98,25.51 R98.2 69.66,25.23 v1(69.61,25.28) ; OPAVP3.1 74.72,32.37 R79.1 ; 75.59,31.76 75.5,31.67
  Top Layer w0.381: 75.59,34.04 75.59,31.76
  Bottom Layer w0.254: v1(78.24,25.51) 79.31,25.51 v1(82.96,21.86) ; OPAVP3.1 v1(69.61,25.28)
OUT0P: length 23.4
  Top Layer w0.254: R97.2 73.92,24.78 v1(73.79,24.78) ; Test0P.1 v1(72.94,20.51) ; OPAVP0.1 79.49,31.04 v1(78.77,30.32) R80.1
  Top Layer w0.381: 76.78,34.17 76.78,32.33 77.54,31.56
  Bottom Layer w0.254: v1(78.77,30.32) 78.77,30.29 73.79,25.31 v1(73.79,24.78) 73.79,21.36 v1(72.94,20.51)
OUT1N: length 36.3
  Top Layer w0.254: v4(41.76,23.76) 41.81,23.76 44.49,21.08 v1(44.49,20.08) ; v1(41.74,13.98) 40.45,13.98 Test1N.2
  Top Layer w0.381: 41.18,31.94 41.68,32.43 41.68,34.91
  Top Layer w0.508: 41.15,31.89 40.09,31.89 38.86,33.12 34.35,33.12
  Bottom Layer w0.254: v1(44.49,20.08) 44.49,16.73 v1(41.74,13.98) ; v4(41.76,23.76) 34.34,31.18 OPAVN1.1
OUT1P: length 46.3
  Top Layer w0.254: R94.1 46.26,27.18 v4(45.19,27.18) ; v1(28.94,18.63) 28.94,16.18 Test1P.1 ; R83.1 44.68,31.84 v4(45.09,31.43)
  Top Layer w0.381: 43.07,34.53 42.97,34.42 ; 42.97,34.42 42.97,36.25 41.77,37.46 32.65,37.46 30.82,35.63 OPAVP1.1 ; 42.97,34.42 42.99,34.4 42.99,32.38 43.45,31.92
  Bottom Layer w0.254: v4(45.09,31.43) 45.19,31.33 v4(45.19,27.18)
  Bottom Layer w0.381: v1(28.94,18.63) 28.94,31.21 OPAVP1.1
OUT2N: length 44.9
  Top Layer w0.254: U25.6 7.2,31.59 R84.1 6.09,30.48 3.08,30.48 3.08,30.58 2.97,30.69 ; OPAVN2.1 3.49,29.93 Test2N.2 ; v4(21.91,25.48) 22.53,24.86 27.9,24.86 R95.1
  Bottom Layer w0.254: v4(21.91,25.48) 16.59,25.48 16.54,25.43 13.89,25.43 12.69,24.23 6.19,24.23 2.94,27.47 OPAVN2.1
OUT2P: length 39.8
  Top Layer w0.254: R96.1 26.42,28.6 v1(26.09,28.93) ; 9.23,30.76 8.59,31.39 ; 5.59,23.78 9.19,23.78 v3(10.66,25.26) ; 9.29,31.02 11.62,31.02 13.49,29.15
  Top Layer w0.381: 8.59,31.39 8.59,34.34
  Bottom Layer w0.254: v1(26.09,28.93) 26.09,29.02 22.25,32.86 12.69,32.86 v3(10.84,31) 10.84,25.43 v3(10.66,25.26)
PA09: length 16.9
  Top Layer w0.254: v1(52.61,15.96) 52.64,15.98 C132.1 54.94,16.88 57.51,16.88 R100.1 ; 46.02,19.5 46.02,18.59
  Bottom Layer w0.254: v1(52.61,15.96) 51.14,17.43 46.19,17.43 45.64,17.98 45.64,19.13 v1(46.01,19.51)
PB07: length 8.8
  Top Layer w0.254: 47.02,18.59 47.02,19.05 47.26,19.3 47.26,20.88 47.94,21.56 48.94,21.56 49.91,20.59 49.91,20.13 49.84,20.06 51.29,18.6 51.29,18.18
PB08: length 26.2
  Top Layer w0.254: v1(46.56,19.96) 46.59,19.93 46.59,18.67 U22.25 ; v1(61.64,26.68) 62.54,26.68 R99.1 65.81,27.78 C131.1
  Bottom Layer w0.254: v1(46.56,19.96) 47.06,19.96 47.72,19.3 48.75,19.3 53.71,24.26 53.71,25.38 56.36,28.03 60.29,28.03 v1(61.64,26.68)
RX: length 18.4
  Top Layer w0.254: 65.74,9.78 65.79,9.83 ; 65.81,10.01 65.81,9.98 64.46,11.33 52.24,11.33 49.63,13.93 U22.12
SWDCLK: length 33
  Top Layer w0.254: U22.13 49.73,14.43 52.29,11.88 71.44,11.88 77.41,5.91 CN12.2
SWDIO: length 35
  Top Layer w0.254: U22.14 49.83,14.93 52.37,12.4 72.17,12.4 CN12.3
TX: length 15.8
  Top Layer w0.254: CN13.3 61.96,10.83 52.21,10.83 49.61,13.43 U22.11
$1N35: length 4.2
  Top Layer w0.762: R35.2 88.74,23.13 LED1.2
$1N38: length 13.1
  Top Layer w0.254: U22.8 47.51,9.02 X1.1 42.85,4.36 C68.1
$1N39: length 11.8
  Top Layer w0.254: 54.94,5.76 54.91,5.73 51.74,5.73 48.02,9.45 48.02,12.78
$1N45: length 7.2
  Top Layer w0.254: U22.2 44.51,12.32 43.43,11.23 38.21,11.23
$1N51: length 14
  Top Layer w0.381: 71.88,53.45 71.88,51.77 71.95,51.7 ; 75.66,45.23 75.5,45.39 75.5,46.56 75.75,46.81 75.75,48.54 76.05,48.84 76.05,50.84 76.05,50.83 76.05,52.84 75.72,53.17 ; 75.7,53.22 75.59,53.33 71.93,53.33
$1N52: length 14.6
  Top Layer w0.381: 77.42,50.89 77.9,50.41 77.9,48.58 ; 77.94,53.1 82.05,53.1 D10.1 ; 77.94,53.1 77.88,53.1 ; 77.94,53.1 77.46,52.63 77.46,50.85 77.47,50.84 ; 77.94,53.1 77.95,53.12 ; 82.05,53.1 82.08,53.13 ; 77.9,48.58 77.9,48.56 ; 77.9,48.58 77.92,48.61 ; 77.9,48.58 76.81,47.49 76.81,45.28
$1N62: length 14.7
  Top Layer w0.381: 6.37,52.98 5.94,53.42 2.45,53.42 2.45,52.84 ; 6.37,52.98 6.57,52.98 6.9,52.65 6.9,51.03 ; 6.37,52.98 6.33,52.98 ; 6.37,52.98 6.38,52.98 ; 6.38,48.95 6.38,47.65 7.2,46.82 7.2,45.19 ; 6.86,51.16 6.86,49.36 6.39,48.89 ; 2.44,52.82 2.45,52.83 2.43,51.74
$1N63: length 15.9
  Top Layer w0.381: 9.16,48.69 9.16,50.47 8.32,51.31 ; 9.16,48.69 9.16,48.66 ; 9.16,48.69 8.53,48.07 8.53,45.34 ; 9.16,48.69 9.19,48.73 ; 8.25,51.1 8.25,53.13 8.52,53.39 13.3,53.39 13.47,53.56 13.54,53.49 13.54,51.81
$1N73: length 16.2
  Top Layer w0.381: 48.69,53.83 48.64,53.88 47.17,53.88 46.79,53.51 43.72,53.51 ; 48.59,52.21 48.64,52.25 48.64,53.87 ; 43.66,53.51 43.72,53.51 ; 43.72,53.51 43.16,52.94 43.16,51.21 ; 44,48.67 42.91,47.58 42.91,45.34 ; 44,48.67 44.04,48.71 ; 44,48.67 44.02,48.71 44.02,50.36 43.16,51.21 ; 43.16,51.21 43.16,51.12
$1N74: length 14.3
  Top Layer w0.381: 37.83,53.68 41.2,53.68 41.52,53.35 ; 41.78,48.84 41.78,46.8 41.64,46.66 41.64,45.09 41.63,45.08 ; 41.76,51.08 41.76,53.1 41.39,53.46 ; 37.79,53.69 37.77,53.67 37.77,51.98 ; 41.81,48.83 41.81,51.23
$1N99: length 2.2
  Top Layer w0.254: R58.2 36.81,13.63 U29.5
$1N101: length 2.3
  Top Layer w0.254: U29.3 30.07,14.28 29.83,14.03 R63.2
$1N107: length 7.6
  Top Layer w0.254: 16.19,21.72 14.6,21.72 13.17,20.29 9.17,20.29
$1N109: length 2.8
  Top Layer w0.254: 9.14,22.86 9.8,22.86 10.28,22.38 11.69,22.38 11.7,22.36
$1N117: length 3.3
  Top Layer w0.254: U24.5 84.76,13.38 R42.2
$1N119: length 5.8
  Top Layer w0.254: v1(74.66,14.03) U24.3 ; v1(74.61,15.86) 74.67,15.91 74.67,17.01
  Bottom Layer w0.254: v1(74.66,14.03) 74.66,15.81 v1(74.61,15.86)
$1N17170: length 1.9
  Top Layer w0.254: R63.1 27.69,14.37 Test1P.2
$1N17195: length 1.6
  Top Layer w0.254: 40.44,13.1 40.4,13.13 R58.1
$1N17308: length 5.1
  Top Layer w0.254: 7.65,20.34 7.62,20.31 5.98,20.31 3.53,22.75
$1N17335: length 2
  Top Layer w0.254: 5.58,22.83 7.46,22.83 7.55,22.92
$1N17442: length 2.4
  Top Layer w0.254: Test0N.1 84.89,17.07 R42.1
$1N17455: length 1.7
  Top Layer w0.254: Test0P.2 74.63,18.55 R76.1
$1N17553: length 2
  Top Layer w0.254: Test1B.1 37.27,14.93 U29.7
$1N17583: length 3.2
  Top Layer w0.254: U29.1 32.14,15.58 32.78,16.22 Test1A.1
$1N17697: length 10.1
  Top Layer w0.254: Test0A.2 77.33,15.26 U24.1
$1N17712: length 18.8
  Top Layer w0.254: U22.16 50.26,15.93 52.46,13.73 64.96,13.73 66.46,15.23
$1N17720: length 18.3
  Top Layer w0.254: U22.15 50.13,15.43 52.41,13.16 Test0B.1
$1N17725: length 15.2
  Top Layer w0.254: Test0B.2 70.31,13.16 70.62,12.85 79.03,12.85 80.86,14.68 U24.7
$1N17845: length 8.4
  Top Layer w0.254: 11.65,23.69 13.1,23.69 14.17,24.76 19.59,24.76 19.6,24.78
$1N17858: length 3.8
  Top Layer w0.254: 15.87,23.02 17.26,23.02 17.61,22.66 19.51,22.66
$1N27493: length 14.5
  Top Layer w0.254: MID1.2 79.59,12.86 80.76,14.03 U24.6 82.86,14.03 83.26,14.43 83.26,16.21 82.96,16.51 80.31,16.51 78.46,14.66 77.43,14.66 U24.2
$1N27815: length 9.1
  Top Layer w0.254: 16.19,22.3 16.27,22.38 17.13,22.38 19.23,20.28 19.86,20.28 ; 11.9,23.03 13.31,23.03 13.96,22.38 16.1,22.38
$1N57531: length 20.3
  Top Layer w0.254: 33.16,14.28 U29.6 ; 33.16,14.28 33.16,12.73 32.49,12.06 26.59,12.06 23.12,15.52 23.12,17.98 ; 33.16,14.28 32.51,14.93 U29.2
$1N59692: length 21.4
  Top Layer w0.254: 75.18,27.69 75.38,27.89 75.38,29.92 ; 75.43,30.12 75.36,30.19 58.65,30.19 57.9,29.44 57.9,28.23
$1N60067: length 30
  Top Layer w0.254: 61.45,26.09 61.43,26.11 ; 61.45,26.09 57.47,26.09 56.57,26.99 56.57,28.37 ; 61.45,26.09 64.69,22.85 ; 61.45,26.09 75.45,26.09 77.45,28.1 77.45,30.01
$1N60115: length 24.2
  Top Layer w0.254: 62.88,22.81 62.83,22.86 62.83,23.5 62.03,24.3 58.01,24.3 56.96,25.35 55.84,25.35 54.07,27.12 54.07,29.17 52.88,30.37 43.41,30.37
$1N60127: length 57.9
  Top Layer w0.254: 54.05,22.62 54.05,24.85 52.73,26.16 41.64,26.16 36.78,31.02 20.52,31.02 17.17,27.68 10.64,27.68 9.05,29.28 ; 54.02,22.55 54.02,21.56 53.54,21.08 53.54,19.23 54.93,17.83 55.23,17.83 55.46,17.61
$1N60296: length 15
  Top Layer w0.254: 41.04,30.26 41.13,30.17 41.13,28.15 ; 41.07,30.32 41.86,29.53 52.12,29.53 52.77,28.88 52.77,28.29
$1N60318: length 54.5
  Top Layer w0.254: 6.66,27.42 6.56,27.52 6.56,29.36 7.57,29.36 9.92,27.01 17.82,27.01 21.09,30.28 36.54,30.28 41.39,25.42 51.43,25.42 52.78,24.07 52.78,22.66
$1N60454: length 5
  Top Layer w0.254: 56.49,22.59 56.64,22.44 56.64,20.16 57.08,19.71 ; 59.06,19.61 59.04,19.59 57.15,19.59
$1N60500: length 15.5
  Top Layer w0.254: Test1B.2 38.38,15.81 v1(38.39,15.81) ; U22.21 48.51,19.18 48.71,19.38 48.71,20.1
  Bottom Layer w0.254: v1(38.39,15.81) 43.54,20.96 46.89,20.96 47.74,20.11 v1(48.71,20.11)
$1N60507: length 19
  Top Layer w0.254: v1(34.61,17.43) 33.7,17.43 Test1A.2 ; 48.02,18.59 48.06,18.64 v1(48.06,20.66)
  Bottom Layer w0.254: v1(48.06,20.66) 48.06,20.91 47.16,21.81 40.91,21.81 36.54,17.43 v1(34.61,17.43)
$1N60626: length 19.7
  Top Layer w0.254: 59.4,21.39 62.8,21.39 62.89,21.3 64.76,21.3 ; 59.4,21.39 58.13,21.39 57.9,21.62 57.9,22.97 ; 59.4,21.39 59.02,21.77 ; 59.2,23.12 59.2,22.85 59.02,22.67 ; R88.1 57.17,17.81 57.21,17.84 62.48,17.84 64.88,20.24 64.88,21.53
$1N61781: length 26.6
  Top Layer w0.254: Test2A.2 22.92,22.28 33.91,22.28 40.26,15.93 U22.35
$1N61787: length 25.6
  Top Layer w0.254: U22.36 39.86,15.43 34.24,21.06 22.1,21.06 20.69,22.47
$1N61993: length 5.3
  Top Layer w0.254: C128.1 45.69,21.18 ; 45.69,21.18 45.72,21.16 ; 45.69,21.18 45.69,20.67 45.02,20 45.02,18.59
$1N62045: length 13.5
  Top Layer w0.254: 48.94,27.18 48.94,27.16 v1(48.89,27.11) 47.84,27.11 R94.2 ; v1(50.46,23.61) C127.1 45.44,19.86 45.44,18.67 U22.27
  Bottom Layer w0.254: v1(48.89,27.11) 49.34,27.11 50.46,25.98 v1(50.46,23.61)
$1N62136: length 20.2
  Top Layer w0.254: 44.02,18.59 44.02,19.43 37.21,26.23 31.49,26.23 C129.1 30.29,27.33 R96.2
$1N62140: length 17.2
  Top Layer w0.254: R95.2 31.71,24.81 C130.1 34.64,24.88 42.58,16.93 U22.33
$1N62248: length 27.3
  Top Layer w0.254: C126.1 71.96,22.68 R98.1 68.33,22.68 60.46,14.81 52.91,14.81 49.78,17.93 U22.20
$1N62264: length 32.2
  Top Layer w0.254: U22.19 49.54,17.43 52.54,14.43 61.29,14.43 68.21,21.36 73.39,21.36 R97.1 76.61,22.58 C1.1
$1N62648: length 19.1
  Top Layer w0.254: 61.24,29.36 62.13,28.46 R99.2 ; 61.24,29.36 73.22,29.36 73.76,28.82 73.76,27.71 ; 61.24,29.36 59.23,29.36 59.03,29.15 59.03,28.19
$1N62869: length 27.1
  Top Layer w0.254: 51.5,28.12 51.49,28.1 51.49,27.23 51.14,26.88 50.54,26.88 49.39,28.03 42.78,28.03 ; 51.5,28.12 U31.7 ; 51.5,28.12 51.5,27.04 51.89,26.65 53.19,26.65 54.61,25.23 v1(54.61,25.18) ; R100.2 v1(59.87,17.18)
  Bottom Layer w0.254: v1(59.87,17.18) 57.26,19.78 57.26,23.46 55.54,25.18 v1(54.61,25.18)
$1N62918: length 55.3
  Top Layer w0.254: 51.52,20.48 51.21,20.17 49.87,21.51 49.87,22.31 50.38,22.82 51.1,22.82 51.48,22.44 51.48,23.93 50.67,24.75 41.1,24.75 36.19,29.66 21.31,29.66 18.13,26.48 7.09,26.48 6.64,26.04

## Copper pours and planes (outline as drawn; the poured copper is in the pictures)
AGND on Top Layer: 70.11,15.36 74.99,20.23 77.39,20.23 84.71,27.56 84.71,38.71 0.96,38.71 0.94,38.68 0.94,25.43 1.71,24.66 22.59,24.66 26.85,20.39 48.3,20.39 53.34,15.36
AGND on Bottom Layer: 70.11,15.38 74.99,20.26 77.39,20.26 84.71,27.58 84.71,38.73 0.96,38.73 0.94,38.71 0.94,25.46 1.71,24.68 22.59,24.68 26.85,20.42 48.3,20.42 53.34,15.38
DGND on Top Layer: 0.85,24.14 1.12,24.41 23.25,24.41 27.14,20.51 48.04,20.51 53.69,14.86 70.87,14.86 71.15,14.59 85.17,28.61 88.54,28.61 90.77,26.38 90.77,5.18 87.13,1.54 6.12,1.54 0.58,7.08 0.58,24.16 0.83,24.16
DGND on Bottom Layer: 0.85,23.97 1.12,24.24 23.25,24.24 27.14,20.34 48.04,20.34 53.69,14.69 70.87,14.69 71.15,14.42 85.17,28.44 88.54,28.44 90.77,26.22 90.77,5.01 87.13,1.37 6.12,1.37 0.58,6.92 0.58,23.99 0.83,23.99
ISOGND0 on Top Layer: 69.66,59.48 69.66,44.22 71.93,41.96 89.56,41.96 90.14,42.53 90.14,59.53 69.71,59.53
ISOGND0 on Bottom Layer: 69.64,59.58 69.64,44.32 71.9,42.06 89.54,42.06 90.11,42.63 90.11,59.63 69.69,59.63
ISOGND1 on Top Layer: 35.59,60.03 35.59,43.26 36.76,42.08 54.59,42.08 55.86,43.36 55.86,58.96 54.81,60.01 35.69,60.01 35.66,60.03
ISOGND1 on Bottom Layer: 35.59,60.03 35.59,43.26 36.76,42.08 54.59,42.08 55.86,43.36 55.86,58.96 54.81,60.01 35.69,60.01 35.66,60.03
ISOGND2 on Top Layer: 1.64,59.31 20.81,59.31 21.31,58.81 21.31,42.68 20.74,42.11 2.56,42.11 1.49,43.18 1.49,59.16
ISOGND2 on Bottom Layer: 1.59,59.31 20.76,59.31 21.26,58.81 21.26,42.68 20.69,42.11 2.51,42.11 1.44,43.18 1.44,59.16

Small or netless copper shapes (teardrops, artwork), in the pictures only: 18 on Top Layer

## Text on the board
Top Silkscreen Layer: ISOGND2 | ISOGND1 | DGND | TX | RX | +5V | ISOGND0 | SWCLK | SWDIO | +HV2 | +HV1 | +HV0
